# EasyEDA Pro project 主板.epro, schematic 主板
Create Date: 2024-05-25; Page Name: P1; Project Name: 独轮主板; Schematic Name: 主板; Update Date: 2024-05-31; Company: 嘉立创EDA; Page Size: A4; Version: V1.0
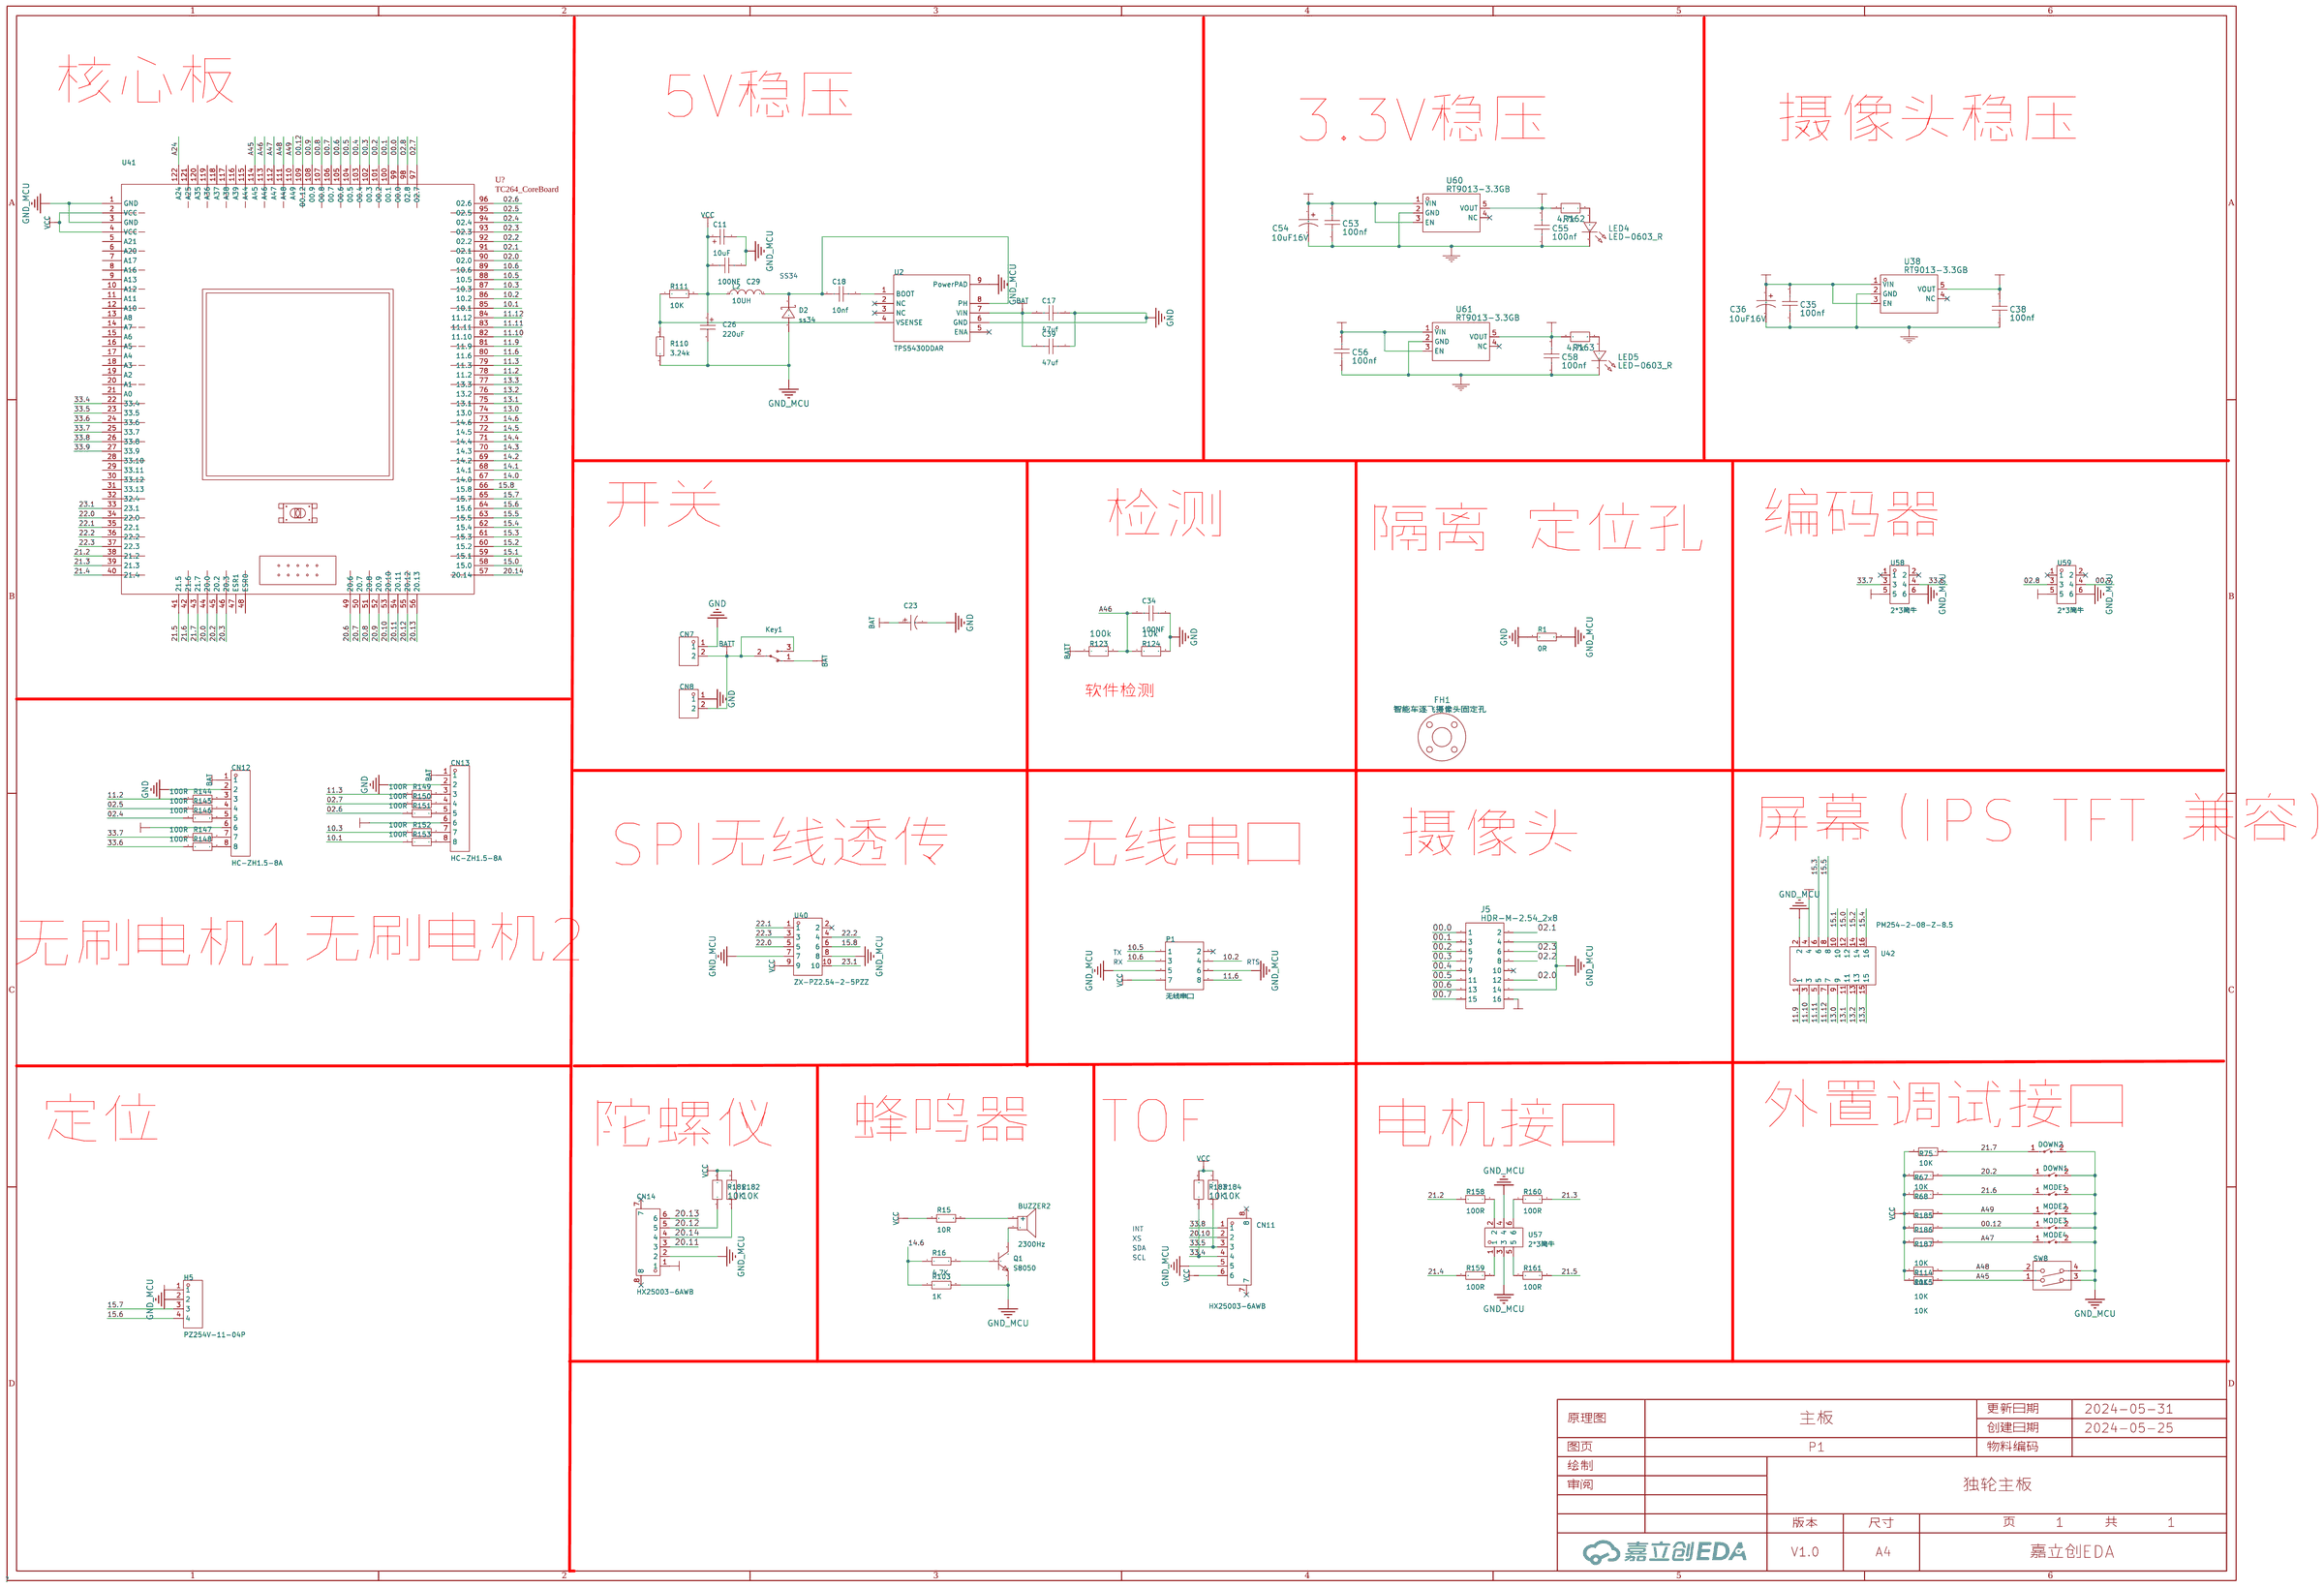
[diagram p0: schematic sheet]

## Parts
BUZZER2  2300Hz  [BUZ-TH_BD12.0-P7.60-D0.6-FD]
C11  10uF  [CAP-SMD_L3.2-W1.6-RD]
C17  47uf  [R0805_1]
C18  10nf  [电容0603 ad]
C23  470uf  [CAP-TH_BD8.0-P3.50-D0.6-FD]
C26  220uF  [CASE-D_7343]
C29  100NF  [C0805_1]
C34  100NF  [电容0603 ad]
C35  100nf  [电容0603 ad]
C36  10uF16V  [CASE-A_3216]
C38  100nf  [电容0603 ad]
C39  47uf  [R0805_1]
C53  100nf  [电容0603 ad]
C54  10uF16V  [CASE-A_3216]
C55  100nf  [电容0603 ad]
C56  100nf  [电容0603 ad]
C58  100nf  [电容0603 ad]
CN7  电机1  [conn-th_xt30u-m]
CN8  电机1  [conn-th_xt30u-m]
CN11  HX25003-6AWB  [CONN-SMD_6P-P2.50_HX25003-6AWB]
CN12  HC-ZH1.5-8A  [CONN-TH_HC-ZH1.5-8A]
CN13  HC-ZH1.5-8A  [CONN-TH_HC-ZH1.5-8A]
CN14  HX25003-6AWB  [CONN-SMD_6P-P2.50_HX25003-6AWB]
D2  ss34  [SMA_L4.3-W2.6-LS5.2-RD]
DOWN1  ST-1101NE-H H=4.3mm  [SW-SMD_L6.0-W3.5-LS8.0]
DOWN2  ST-1101NE-H H=4.3mm  [SW-SMD_L6.0-W3.5-LS8.0]
FH1  智能车逐飞摄像头固定孔  [智能车逐飞摄像头支架固定孔]
H5  PZ254V-11-04P  [HDR-TH_4P-P2.54-V-M]
J5  HDR-M-2.54_2x8  [HDR-M-2.54_2X8]
Key1  -  [MTS102/3脚2档]
L2  10UH  [IND-SMD_L7.3-W6.8]
LED4  LED-0603_R  [LED0603_RED]
LED5  LED-0603_R  [LED0603_RED]
MODE1  ST-1101NE-H H=4.3mm  [SW-SMD_L6.0-W3.5-LS8.0]
MODE2  ST-1101NE-H H=4.3mm  [SW-SMD_L6.0-W3.5-LS8.0]
MODE3  ST-1101NE-H H=4.3mm  [SW-SMD_L6.0-W3.5-LS8.0]
MODE4  ST-1101NE-H H=4.3mm  [SW-SMD_L6.0-W3.5-LS8.0]
P1  无线串口  [HDR-TH_8P-P2.54-V-M-R2-C4-S2.54]
Q1  S8050  [SOT-23-3_L2.9-W1.6-P1.90-LS2.8-BR]
R1  0R  [R0805_1]
R15  10R  [r0603 ad]
R16  4.7K  [r0603 ad]
R67  10K  [r0603 ad]
R68  10K  [r0603 ad]
R75  10K  [r0603 ad]
R103  1K  [r0603 ad]
R110  3.24k  [r0603 ad]
R111  10K  [r0603 ad]
R114  10K  [r0603 ad]
R115  10K  [r0603 ad]
R123  100k  [r0603 ad]
R124  10k  [r0603 ad]
R144  100R  [r0603 ad]
R145  100R  [r0603 ad]
R146  100R  [r0603 ad]
R147  100R  [r0603 ad]
R148  100R  [r0603 ad]
R149  100R  [r0603 ad]
R150  100R  [r0603 ad]
R151  100R  [r0603 ad]
R152  100R  [r0603 ad]
R153  100R  [r0603 ad]
R158  100R  [r0603 ad]
R159  100R  [r0603 ad]
R160  100R  [r0603 ad]
R161  100R  [r0603 ad]
R162  4.7k  [r0603 ad]
R163  4.7k  [r0603 ad]
R181  10K  [r0603 ad]
R182  10K  [r0603 ad]
R183  10K  [r0603 ad]
R184  10K  [r0603 ad]
R185  10K  [r0603 ad]
R186  10K  [r0603 ad]
R187  10K  [r0603 ad]
SW8  DSWB02LHGET  [SW-TH_DSWB02LHGET]
U2  TPS5430DDAR  [soic-8_l5.0-w4.0-p1.27-ls6.0-tl-ep]
U38  RT9013-3.3GB  [SOT-23-5_L2.9-W1.6-P0.94-LS2.8-BL]
U40  ZX-PZ2.54-2-5PZZ  [HDR-TH_10P-P2.54-V-M-R2-C5-S2.54]
U41  -  [TC264]
U42  PM254-2-08-Z-8.5  [HDR-TH_16P-P2.54-V-F-R2-C8-S2.54]
U57  2*3简牛  [CONN-TH_6P-P2.54_KINGHELM_KH-2.54PH180-2X3P-L8.9]
U58  2*3简牛  [CONN-TH_6P-P2.54_KINGHELM_KH-2.54PH180-2X3P-L8.9]
U59  2*3简牛  [CONN-TH_6P-P2.54_KINGHELM_KH-2.54PH180-2X3P-L8.9]
U60  RT9013-3.3GB  [SOT-23-5_L2.9-W1.6-P0.94-LS2.8-BL]
U61  RT9013-3.3GB  [SOT-23-5_L2.9-W1.6-P0.94-LS2.8-BL]

## Library data of the parts
BUZZER2 = TMB12A12_C96079: 驱动方式:有源(内含驱动线路);构造类型:电磁式;额定电压:12V;工作电压:8V~16V;频率:2300Hz;声压(SPL):85dB@12V,10cm;直径(φD):12mm;高度:9.8mm;; LCSC Part Name: TMB12A12; Supplier Part: C96079; Manufacturer: 华能; Manufacturer Part: TMB12A12; Supplier Footprint: 插件,P=7.6mm; JLCPCB Part Class: Extended Part; Datasheet: https://atta.szlcsc.com/upload/public/pdf/source/20170522/1495448324467.pdf; Supplier: LCSC; Oscillator Circuit: 有源(内含驱动线路); Technology Type: 电磁式; Rated Voltage: 12V; Operating Voltage: 8V~16V; Sound Pressure Level (SPL): 85dB@12V,10cm; Diameter (φD): 12mm; Height: 9.8mm
C11 = CA45-A-10V-10uF-K: 容值:10uF;精度:±10%;额定电压:10V;等效串联电阻:8Ω@100kHz;; LCSC Part Name: 10uF ±10% 10V; Supplier Part: C128253; Manufacturer: CEC(振华新云); Supplier Footprint: CASE-A-3216; JLCPCB Part Class: Extended Part; Datasheet: https://atta.szlcsc.com/upload/public/pdf/source/20170914/C128253_1505359751786967904.pdf; Supplier: LCSC; Tolerance: ±10%; Rated Voltage: 10V; Equivalent Series Resistance(ESR): 8Ω@100kHz; Operating Temperature: -55℃~+125℃
C17 C18 C29 C34 C39 = CAP_604: Supplier Footprint: 0603
C23 = KM107M050F12RR0VH2FP0: 容值:100uF;精度:±20%;额定电压:50V;电容体直径:8mm;电容体长度:12mm;脚间距:3.5mm;工作寿命:2000hrs@105℃;; LCSC Part Name: 100uF ±20% 50V; Supplier Part: C2749; Manufacturer: CX(承兴); Supplier Footprint: 插件,D8xL12mm; JLCPCB Part Class: 扩展库; Datasheet: https://atta.szlcsc.com/upload/public/pdf/source/20211027/06D6BA3719C264B639DC286D935D03EA.pdf; Supplier: LCSC; Tolerance: ±20%; Rated Voltage: 50V; φD: 8mm; L: 12mm; Lead Spacing: 3.5mm; Lifetime @ Temp: 2000hrs@105℃
C26 = TAJD227K010RNJ: 容值:220uF;精度:±10%;额定电压:10V;等效串联电阻:500mΩ@100kHz;; LCSC Part Name: 220uF ±10% 10V; Supplier Part: C8024; Manufacturer: Kyocera AVX; Supplier Footprint: CASE-D-7343; JLCPCB Part Class: 扩展库; Datasheet: https://atta.szlcsc.com/upload/public/pdf/source/20160107/1457707750208.pdf; Supplier: LCSC; Tolerance: ±10%; Rated Voltage: 10V; Equivalent Series Resistance(ESR): 500mΩ@100kHz; Operating Temperature: -55℃~+125℃
C35 C38 C53 C55 C56 C58 = 0.1u_5: link: https://item.szlcsc.com/373011.html; 3DModel: C0805_L2.0-W1.3-H1.3
C36 C54 = 10uF16V: link: https://item.szlcsc.com/2057730.html; 3DModel: CASE-A_L3.2-W1.6-H1.6; Supplier: LCSC; Supplier Part: C444785; Manufacturer: AVX; Manufacturer Part: TPSA226M006R0900; JLCPCB Part Class: Extended Part
CN7 CN8 = KF301-5.0-2P: 间距:5mm;排数:1;每排PIN数:2;安装方式:直针;额定电流:17A;额定电压:250V;线规 - AWG:14~22;线规 - mm?:1.5;工作温度范围:-30~+120;颜色:蓝色;; LCSC Part Name: 5mm 排数:1 每排P数:2 直针 可拼接 铜 环保; Supplier Part: C474881; Manufacturer: KEFA(科发); Supplier Footprint: P=5mm; JLCPCB Part Class: 扩展库; Datasheet: https://atta.szlcsc.com/upload/public/pdf/source/20200115/C474881_883EFE2003339C40FD1BEEEFC9A18423.pdf; Supplier: LCSC; Pitch: 5mm; Number of Rows: 1; Number of PINs Per Row: 2; Mounting Style: 直针; Current Rating (Max): 17A; Voltage Rating (Max): 250V; Wire Gauge - AWG: 14~22; Wire Gauge - mm?: 1.5; Operating Temperature Range: -30~+120; Color: 蓝色
CN11 CN14 = HX25003-6AWB: 参考系列:XH;间距:2.5mm;插针结构:1x6P;排数:1;每排PIN数:6;行距:-;公母:公型插针;安装方式:卧贴;额定电流:-;工作温度范围:-;; LCSC Part Name: 母座 卧贴 2.5mm 6Pin位; Supplier Part: C442365; Manufacturer: HX(红星); Supplier Footprint: SMD,P=2.5mm; JLCPCB Part Class: Extended Part; Datasheet: https://atta.szlcsc.com/upload/public/pdf/source/20191028/C442365_B5FA22023B02331D5CA4C541D5EC92BF.pdf; Supplier: LCSC; Reference Series: XH; Pitch: 2.5mm; Pins Structure: 1x6P; Number of Rows: 1; Number of PINs Per Row: 6; Gender: 公型插针; Mounting Style: 卧贴
CN12 CN13 = HC-ZH1.5-8A: 插针结构:1x8P;间距:1.5mm;安装方式:直插;参考系列:ZH;总PIN数:8P;排数:1;每排PIN数:8;行距:-;额定电流:1A;触头材质:黄铜;触头镀层:锡;工作温度范围:-25℃~+85℃;; LCSC Part Name: 1x8P 间距:1.5mm 直插 系列:ZH; Supplier Part: C2845556; Manufacturer: HCTL(华灿天禄); Supplier Footprint: 插件,P=1.5mm; JLCPCB Part Class: 扩展库; Datasheet: https://atta.szlcsc.com/upload/public/pdf/source/20230711/891FEA77A098E3B44CC72703EA57A8B8.pdf; Supplier: LCSC; Pins Structure: 1x8P; Pitch: 1.5mm; Mounting Style: 直插; Reference Series: ZH; Number of Pins: 8P; Number of Rows: 1; Number of PINs Per Row: 8; Current Rating (Max): 1A; Contact Material: 黄铜; Contact Plating: 锡; Operating Temperature Range: -25℃~+85℃
D2 = B340A-E3/61T: 直流反向耐压（Vr）:40V;平均整流电流（Io）:3A;正向压降（Vf）:550mV @ 3A;; Supplier Part: C15570; Manufacturer: VISHAY(威世); Supplier Footprint: SMA(DO-214AC); JLCPCB Part Class: 扩展库; Datasheet: https://atta.szlcsc.com/upload/public/pdf/source/20130720/1457706624701.pdf; Supplier: LCSC
DOWN1 DOWN2 MODE1-MODE4 = ST-1101NE-H H=4.3mm: 触点电流:50mA;额定电压(DC):12V;绝缘电阻:100MΩ;电路结构:单刀单掷;安装方式:立贴;按钮形状:矩形按钮;按钮/盖帽颜色:白色;作用力:260gf@±50gf;机械寿命:30000;工作温度:-20℃~+80℃;引脚样式:鸥翼型;开关长度:6mm;开关宽度:3.5mm;开关高度:4.3mm;带支架:否;; LCSC Part Name: 轻触开关 二脚贴片; Supplier Part: C695407; Manufacturer: RISHENG(日昇); Supplier Footprint: SMD; JLCPCB Part Class: 扩展库; Datasheet: https://atta.szlcsc.com/upload/public/pdf/source/20200922/C695407_01C8FA18BEAAC1F51CB6DE34E1BDC7C2.pdf; Supplier: LCSC; Contact Current: 50mA; Voltage Rating (DC): 12V; Insulation Resistance: 100MΩ; Circuit: 单刀单掷; Mounting Style: 立贴; Actuator Style: 矩形按钮; Actuator/Cap Color: 白色; Operating Force: 260gf@±50gf; Mechanical Life: 30000; Operating Temperature: -20℃~+80℃; Pin Style: 鸥翼型; Switch Length: 6mm; Switch Width: 3.5mm; Switch Height: 4.3mm; Strike Gundam: 否
FH1 = 智能车逐飞摄像头固定孔: 3DModel: 逐飞摄像头法兰盘-Body
H5 = PZ254V-11-04P: 插针结构:1x4P;间距:2.54mm;行距:-;圆针/方针:方针;安装类型:直插;排数:单排;总PIN位数:4P;额定电流:3A;额定电压:250V;配合针长度:6mm;塑高:2.5mm;端接针长度:3mm;触头材质:-;工作温度范围:-40℃~+105℃;颜色:黑色;; LCSC Part Name: 间距:2.54mm 1x4P 直插 方针; Supplier Part: C2691448; Manufacturer: XFCN(兴飞); Supplier Footprint: 插件,P=2.54mm; JLCPCB Part Class: 扩展库; Datasheet: https://atta.szlcsc.com/upload/public/pdf/source/20200309/C492403_F9F19131791D08044AD4F84F8E751A34.pdf; Supplier: LCSC; Pin Structure: 1x4P; Pitch: 2.54mm; Circluar Pins/Square Pins: 方针; Mounting Type: 直插; Number of Rows: 单排; Number of Pins: 4P; Current Rating (Max): 3A; Voltage Rating (Max): 250V; Length of Mating Pin: 6mm; Insulation Height: 2.5mm; Length of End Connection Pin: 3mm; Operating Temperature Range: -40℃~+105℃; Color: 黑色
J5 = HDR-M-2.54_2x8_1: Supplier Part: C68234; Supplier: LCSC
Key1 = MTS-102: Pin Type: IN
L2 = FXL0630-100-M: 电感值:10uH;精度:±20%;额定电流:4.5A;饱和电流(Isat):5.5A;; LCSC Part Name: 10uH ±20% 4.5A 62mΩ; Supplier Part: C167223; Manufacturer: cjiang(长江微电); Supplier Footprint: SMD,6.6x7mm; JLCPCB Part Class: 扩展库; Datasheet: https://atta.szlcsc.com/upload/public/pdf/source/20190322/C167223_8858C3FC3676E2A39A1CDEAF2C3E5524.pdf; Supplier: LCSC; Tolerance: ±20%; Rated Current: 4.5A; Saturation Current (Isat): 5.5A; DC Resistance (DCR): 62mΩ
LED4 LED5 = LED-0603_R: 3DModel: LED0603_Red; Manufacturer: EVERLIGHT(台湾亿光); Manufacturer Part: 19-217/R6C-AL1M2VY/3T; Supplier Part: C72044; Supplier: LCSC
P1 = 直排针2X4P 2.54mm: 圆针/方针:-;额定电流:-;额定电压:-;配合针长度:-;塑高:-;触头材质:-;; LCSC Part Name: 排针 2*4P 2.54mm; Supplier Part: C58363; Manufacturer: BOOMELE(博穆精密); Supplier Footprint: 插件,P=2.54mm; JLCPCB Part Class: Extended Part; Datasheet: https://atta.szlcsc.com/upload/public/pdf/source/20151026/1457707506726.pdf; Supplier: LCSC
Q1 = S8050_C105433: 晶体管类型:NPN;集射极击穿电压(Vceo):25V;集电极电流(Ic):500mA;功率(Pd):300mW;集电极截止电流(Icbo):100nA;集电极-发射极饱和电压(VCE(sat)@Ic,Ib):600mV@500mA,50mA;直流电流增益(hFE@Ic,Vce):120@50mA,1V;特征频率(fT):150MHz;工作温度:+150℃@(Tj);; LCSC Part Name: NPN 25V 500mA L档 120-200; Supplier Part: C105433; Manufacturer: CJ(江苏长电/长晶); Supplier Footprint: SOT-23-3L; JLCPCB Part Class: 扩展库; Datasheet: https://atta.szlcsc.com/upload/public/pdf/source/20170415/1492237762328.pdf; Supplier: LCSC; Transistor Type: NPN; Collector-Emitter Breakdown Voltage (Vceo): 25V; Collector Current (Ic): 500mA; Power Dissipation (Pd): 300mW; Collector Cut-Off Current (Icbo): 100nA; Collector-Emitter Saturation Voltage (VCE(sat)@Ic,Ib): 600mV@500mA,50mA; DC Current Gain (hFE@Ic,Vce): 120@50mA,1V; Transition Frequency (fT): 150MHz; Operating Temperature: +150℃@(Tj)
R1 R15 R16 R67 R68 R75 R103 R114 R115 R185-R187 = RWB100R0AL: Supplier Part: C9900003644; Supplier Footprint: R0805; JLCPCB Part Class: 扩展库; Supplier: LCSC
R110 R111 R144-R153 = Res_0603: Supplier Footprint: 0603
R123 R124 R181-R184 = FRC0603J472 TS: LCSC Part Name: 4.7KΩ ±5%; Supplier Part: C2907166; Manufacturer: FOJAN(富捷); Supplier Footprint: 0603; JLCPCB Part Class: 扩展库; Datasheet: https://atta.szlcsc.com/upload/public/pdf/source/20211102/08480A48F159CF742D398A1E4DC90941.pdf; Supplier: LCSC
R158-R161 = ERJ3GEY0R00V: 电阻类型:厚膜电阻;阻值:0Ω;精度:-;功率:100mW;温度系数:-;最大工作电压:150V;工作温度范围:-55~+155;; LCSC Part Name: 0Ω 100mW; Supplier Part: C122704; Manufacturer: PANASONIC(松下); Supplier Footprint: 0603; JLCPCB Part Class: 扩展库; Datasheet: https://atta.szlcsc.com/upload/public/pdf/source/20171106/C122704_15099694152271094016.pdf; Supplier: LCSC; Type: 厚膜电阻; Power(Watts): 100mW; Overload Voltage (Max): 150V; Operating Temperature Range: -55~+155
R162 R163 = 4.7k: 3DModel: R0603; link: https://www.mouser.in/datasheet/2/447/PYu_RT_1_to_0_01_RoHS_L_11-1669912.pdf
SW8 = DSWB02LHGET: 类型:平拨,凸起式;电路结构:单刀单掷;开关位数:2位;使用寿命:-;颜色:红色;; LCSC Part Name: 拨码开关,平拨开关,DSWB02LHGET; Supplier Part: C99421; Manufacturer: YE; Supplier Footprint: 插件; JLCPCB Part Class: 扩展库; Datasheet: https://atta.szlcsc.com/upload/public/pdf/source/20230906/EFD9230F686161BBBCD1B62855702D44.pdf; Supplier: LCSC; Type: 平拨,凸起式; Circuit: 单刀单掷; Number of Positions: 2位; Lead Pitch: 2.54mm; Color: 红色
U2 = TPS5430DDAR: 功能类型:降压型;同步整流:-;输出通道数:-;拓扑结构:-;输入电压:-;输出电流(最大值):-;开关频率:-;; LCSC Part Name: 降压型; Supplier Part: C9864; Manufacturer: TI(德州仪器); Supplier Footprint: SO-8; JLCPCB Part Class: 基础库; Datasheet: https://atta.szlcsc.com/upload/public/pdf/source/20161207/1481104217724.pdf; Supplier: LCSC; Function: 降压型
U38 U60 U61 = RT9013-3.3GB: link: https://pdf1.alldatasheet.com/datasheet-pdf/view/304739/POWER/LP4062-B5F.html; Supplier: LCSC; Supplier Part: C9900009203; Manufacturer: null; JLCPCB Part Class: Extended Part
U40 = ZX-PZ2.54-2-5PZZ: 插针结构:2x5P;间距:2.54mm;行距:2.54mm;圆针/方针:方针;安装类型:直插;排数:双排;总PIN位数:5P;额定电流:3A;额定电压:1kV;配合针长度:6mm;塑高:2.5mm;端接针长度:3mm;触头材质:黄铜;触头镀层:金;工作温度范围:-40℃~+105℃;焊接温度(最大值):-;颜色:黑色;; LCSC Part Name: 2x5P 间距:2.54mm 方针 直插; Supplier Part: C7501276; Manufacturer: Megastar(兆星); Supplier Footprint: 插件,P=2.54mm; JLCPCB Part Class: 扩展库; Datasheet: https://atta.szlcsc.com/upload/public/pdf/source/20231122/7DD2FA5A7FDBC10CDDB6051CB6BC6AD1.pdf; Supplier: LCSC; Pin Structure: 2x5P; Pitch: 2.54mm; Row Spacing: 2.54mm; Circluar Pins/Square Pins: 方针; Mounting Type: 直插; Number of Rows: 双排; Number of Pins: 5P; Current Rating (Max): 3A; Voltage Rating (Max): 1kV; Length of Mating Pin: 6mm; Insulation Height: 2.5mm; Length of End Connection Pin: 3mm; Contact Material: 黄铜; Contact Plating: 金; Operating Temperature Range: -40℃~+105℃; Color: 黑色
U41 = TC264
U42 = PM254-2-08-Z-8.5: 排数:双排;总孔位数:16;间距:2.54mm;插孔结构:2x8P;行距:2.54mm;安装类型:直插;圆孔/方孔:方孔;额定电流:3A;额定电压:-;插孔方向:顶部;塑高:8.5mm;工作温度范围:-40℃~+105℃;; LCSC Part Name: 2.54mm 2x8P; Supplier Part: C2897409; Manufacturer: HCTL(华灿天禄); Supplier Footprint: 直插,P=2.54mm; JLCPCB Part Class: 扩展库; Datasheet: https://atta.szlcsc.com/upload/public/pdf/source/20210927/9BB55B81000AC656EEABB4AD384132D3.pdf; Supplier: LCSC; Number of Rows: 双排; Number of Holes: 16; Pitch: 2.54mm; Holes Structure: 2x8P; Row Spacing: 2.54mm; Mounting Type: 直插; Circular Hole / Square Hole: 方孔; Current Rating (Max): 3A; Holes Direction: 顶部; Insulation Height: 8.5mm; Operating Temperature Range: -40℃~+105℃
U57-U59 = KH-2.54PH180-2X3P-L8.9: 连接器类型:简牛座;间距:2.54mm;每排PIN数:3;排数:2;封装形式:直插;; LCSC Part Name: 2.54mm 每排P数:3 排数:2; Supplier Part: C5157626; Manufacturer: kinghelm(金航标); Supplier Footprint: 插件,P=2.54mm; Datasheet: https://atta.szlcsc.com/upload/public/pdf/source/20220902/B59B6B538EA7651002CBD3760F447B01.pdf; Supplier: LCSC; Connector Type: 简牛座; Pitch: 2.54mm; Pin Number in each Row: 3; Number of Rows: 2; Holder Type: 直插

## Nets
3V: C11.1 C26.1 C29.1 C35.2 C36.1 C53.2 C54.1 C56.2 CN11.6 CN14.1 H5.1 L2.1 P1.7 R15.1 R67.1 R68.1 R75.1 R111.2 R114.1 R115.1 R181.2 R182.2 R183.2 R184.2 R185.1 R186.1 R187.1 U38.1(VIN) U38.3(EN) U40.9 U41.2(VCC) U41.4(VCC) U60.1(VIN) U60.3(EN) U61.1(VIN) U61.3(EN)
3V3: C55.2 C58.2 CN12.6 CN13.6 R162.2 R163.2 U42.4 U58.5 U59.5 U60.5(VOUT) U61.5(VOUT)
3V3_CAM: C38.2 J5.16 U38.5(VOUT)
GND: C17.1 C23.2 C34.2 C39.1 CN7.1 CN8.1 CN12.2 CN13.2 R1.1 R124.2 U2.6(GND)
GND_MCU: C11.2 C26.2 C29.2 C35.1 C36.2 C38.1 C53.1 C54.2 C55.1 C56.1 C58.1 CN11.5 CN14.2 D2.2(A) DOWN1.2 DOWN2.2 H5.2 J5.4 J5.14 LED4.2 LED5.2 MODE1.2 MODE2.2 MODE3.2 MODE4.2 P1.5 P1.6 Q1.2 R1.2 R103.2 R110.1 SW8.3 SW8.4 U2.9(PowerPAD) U38.2(GND) U40.7 U40.8 U41.1(GND) U41.3(GND) U42.2 U57.3 U57.4 U58.6 U59.6 U60.2(GND) U61.2(GND)
00.0: J5.1 U41.99(00.0)
00.1: J5.3 U41.100(00.1)
00.2: J5.5 U41.101(00.2)
00.3: J5.7 U41.102(00.3)
00.4: J5.9 U41.103(00.4)
00.5: J5.11 U41.104(00.5)
00.6: J5.13 U41.105(00.6)
00.7: J5.15 U41.106(00.7)
00.8: U41.107(00.8)
00.9: U41.108(00.9) U59.4
00.12: MODE3.1 R186.2 U41.109(00.12)
02.0: J5.12 U41.90(02.0)
02.1: J5.2 U41.91(02.1)
02.2: J5.8 U41.92(02.2)
02.3: J5.6 U41.93(02.3)
02.4: R146.1 U41.94(02.4)
02.5: R145.1 U41.95(02.5)
02.6: R151.1 U41.96(02.6)
02.7: R150.1 U41.97(02.7)
02.8: U41.98(02.8) U59.3
10.1: R153.1 U41.85(10.1)
10.2: P1.4 U41.86(10.2)
10.3: R152.1 U41.87(10.3)
10.5: P1.1 U41.88(10.5)
10.6: P1.3 U41.89(10.6)
11.2: R144.1 U41.78(11.2)
11.3: R149.1 U41.79(11.3)
11.6: P1.8 U41.80(11.6)
11.9: U41.81(11.9) U42.1
11.10: U41.82(11.10) U42.3
11.11: U41.83(11.11) U42.5
11.12: U41.84(11.12) U42.7
13.0: U41.74(13.0) U42.9
13.1: U41.75(13.1) U42.11
13.2: U41.76(13.2) U42.13
13.3: U41.77(13.3) U42.15
14.0: U41.67(14.0)
14.1: U41.68(14.1)
14.2: U41.69(14.2)
14.3: U41.70(14.3)
14.4: U41.71(14.4)
14.5: U41.72(14.5)
14.6: R16.1 R103.1 U41.73(14.6)
15.0: U41.58(15.0) U42.12
15.1: U41.59(15.1) U42.10
15.2: U41.60(15.2) U42.14
15.3: U41.61(15.3) U42.6
15.4: U41.62(15.4) U42.16
15.5: U41.63(15.5) U42.8
15.6: H5.4 U41.64(15.6)
15.7: H5.3 U41.65(15.7)
15.8: U40.6 U41.66(15.8)
20.0: U41.44(20.0)
20.2: DOWN1.1 R67.2 U41.45(20.2)
20.3: U41.46(20.3)
20.6: U41.49(20.6)
20.7: U41.50(20.7)
20.8: U41.51(20.8)
20.9: U41.52(20.9)
20.10: CN11.2 U41.53(20.10)
20.11: CN14.3 U41.54(20.11)
20.12: CN14.5 R181.1 U41.55(20.12)
20.13: CN14.6 U41.56(20.13)
20.14: CN14.4 R182.1 U41.57(20.14)
21.2: R158.1 U41.38(21.2)
21.3: R160.2 U41.39(21.3)
21.4: R159.1 U41.40(21.4)
21.5: R161.2 U41.41(21.5)
21.6: MODE1.1 R68.2 U41.42(21.6)
21.7: DOWN2.1 R75.2 U41.43(21.7)
22.0: U40.5 U41.34(22.0)
22.1: U40.1 U41.35(22.1)
22.2: U40.4 U41.36(22.2)
22.3: U40.3 U41.37(22.3)
23.1: U40.10 U41.33(23.1)
33.4: CN11.4 R183.1 U41.22(33.4)
33.5: CN11.3 R184.1 U41.23(33.5)
33.6: R148.1 U41.24(33.6) U58.4
33.7: R147.1 U41.25(33.7) U58.3
33.8: CN11.1 U41.26(33.8)
33.9: U41.27(33.9)
A24: U41.122(A24)
A45: R115.2 SW8.1 U41.114(A45)
A46: C34.1 R123.2 R124.1 U41.113(A46)
A47: MODE4.1 R187.2 U41.112(A47)
A48: R114.2 SW8.2 U41.111(A48)
A49: MODE2.1 R185.2 U41.110(A49)
BAT: C17.2 C23.1 C39.2 CN12.1 CN13.1 Key1.1 U2.7(VIN)
BATT: CN7.2 CN8.2 Key1.2 Key1.3 R123.1
$1N1871: C18.2 U2.1(BOOT)
$1N1872: C18.1 D2.1(K) L2.2 U2.8(PH)
$1N1875: R110.2 R111.1 U2.4(VSENSE)
$1N3893: BUZZER2.1(+) R15.2
$1N3894: BUZZER2.2 Q1.3
$1N3895: Q1.1 R16.2
$1N44233: CN12.3 R144.2
$1N44311: CN12.4 R145.2
$1N44361: CN12.5 R146.2
$1N44387: CN12.7 R147.2
$1N44413: CN12.8 R148.2
$1N44692: CN13.3 R149.2
$1N44694: CN13.4 R150.2
$1N44696: CN13.5 R151.2
$1N44698: CN13.7 R152.2
$1N44700: CN13.8 R153.2
$1N45394: R160.1 U57.6
$1N45395: R161.1 U57.5
$1N45396: R158.2 U57.2
$1N45397: R159.2 U57.1
$1N50660: LED4.1 R162.1
$1N53160: LED5.1 R163.1

Not connected (* = marked no-connect by the designer): CN11 7* 8*; CN14 7* 8*; J5 10*; P1 2*; U2 2(NC)* 3(NC)* 5(ENA)*; U38 4(NC)*; U40 2*; U41 5(A21) 6(A20) 7(A17) 8(A16) 9(A13) 10(A12) 11(A11) 12(A10) 13(A8) 14(A7) 15(A6) 16(A5) 17(A4) 18(A3) 19(A2) 20(A1) 21(A0) 28(33.10) 29(33.11) 30(33.12) 31(33.13) 32(32.4) 47(ESR1) 48(ESR0) 115(A44) 116(A39) 117(A38) 118(A37) 119(A36) 120(A35) 121(A25); U58 1* 2*; U59 1* 2*; U60 4(NC)*; U61 4(NC)*

## Notes on the sheet
- 核心板
- 5V稳压
- 3.3V稳压
- 摄像头稳压
- SS34
- 开关
- 检测
- 编码器
- 隔离 定位孔
- 软件检测
- 屏幕（IPS TFT 兼容）
- 摄像头
- SPI无线透传
- 无线串口
- TX
- 无刷电机1
- 无刷电机2
- RX
- RTS
- 外置调试接口
- 定位
- 陀螺仪
- 蜂鸣器
- TOF
- 电机接口
- INT
- XS
- SDA
- SCL
